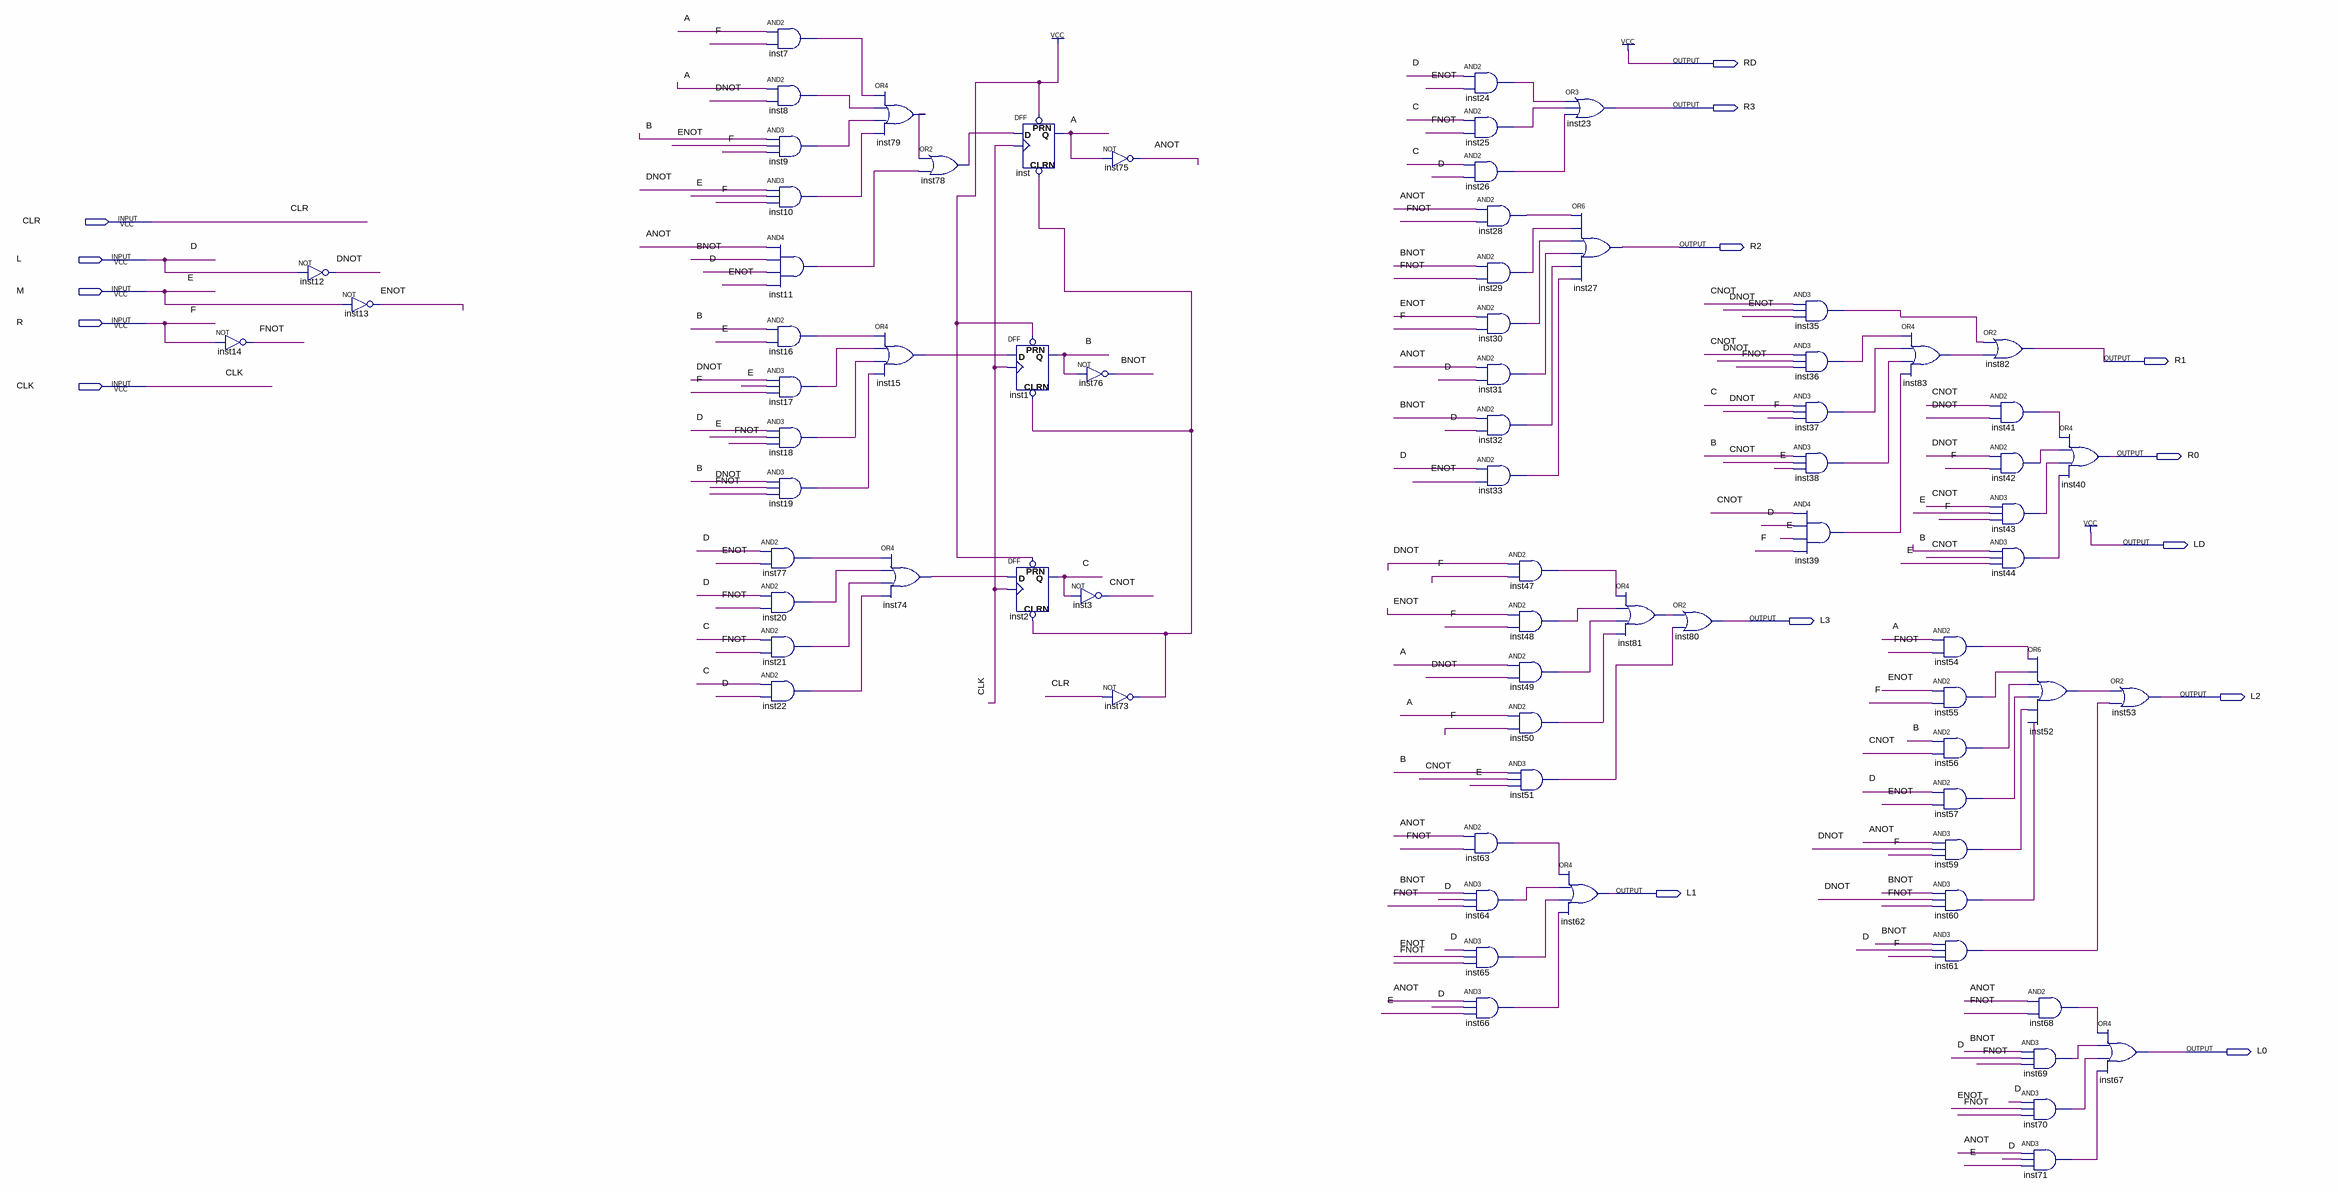
[diagram p0: schematic sheet]
// Quartus schematic SM.bdf as structural Verilog: 76 symbols, 15 pins
module SM (
  input  CLR,
  input  L,
  input  M,
  input  R,
  input  CLK,
  output RD,
  output R3,
  output R2,
  output R1,
  output R0,
  output LD,
  output L3,
  output L2,
  output L1,
  output L0
);

  wire A, ANOT, B, BNOT, C, CNOT, DNOT, ENOT, FNOT, inst7_out, inst8_out, inst9_out, inst10_out, inst11_out,
       inst15_out, inst16_out, inst17_out, inst18_out, inst19_out, inst20_out, inst21_out, inst22_out,
       inst24_out, inst25_out, inst26_out, inst28_out, inst29_out, inst30_out, inst31_out, inst32_out,
       inst33_out, inst35_out, inst36_out, inst37_out, inst38_out, inst39_out, inst41_out, inst42_out,
       inst43_out, inst44_out, inst47_out, inst48_out, inst49_out, inst50_out, inst51_out, inst52_out,
       inst54_out, inst55_out, inst56_out, inst57_out, inst59_out, inst60_out, inst61_out, inst63_out,
       inst64_out, inst65_out, inst66_out, inst68_out, inst69_out, inst70_out, inst71_out, inst73_out,
       inst74_out, inst77_out, inst78_out, inst79_out, inst81_out, inst83_out;

  not inst14 (FNOT, R);
  not inst12 (DNOT, L);
  not inst13 (ENOT, M);
  and inst7 (inst7_out, A, R);
  and inst8 (inst8_out, A, DNOT);
  and inst9 (inst9_out, B, ENOT, R);
  and inst10 (inst10_out, DNOT, M, R);
  and inst11 (inst11_out, ANOT, BNOT, L, ENOT);
  and inst16 (inst16_out, B, M);
  and inst17 (inst17_out, DNOT, M, R);
  and inst18 (inst18_out, L, M, FNOT);
  and inst19 (inst19_out, B, DNOT, FNOT);
  and inst77 (inst77_out, L, ENOT);
  and inst20 (inst20_out, L, FNOT);
  and inst21 (inst21_out, C, FNOT);
  and inst22 (inst22_out, C, L);
  or inst79 (inst79_out, inst7_out, inst8_out, inst9_out, inst10_out);
  or inst78 (inst78_out, inst79_out, inst11_out);
  or inst15 (inst15_out, inst16_out, inst17_out, inst18_out, inst19_out);
  or inst74 (inst74_out, inst77_out, inst20_out, inst21_out, inst22_out);
  DFF inst (.CLRN(inst73_out), .CLK(CLK), .D(inst78_out), .PRN(1'b1), .Q(A));
  DFF inst1 (.CLRN(inst73_out), .CLK(CLK), .D(inst15_out), .PRN(1'b1), .Q(B));
  DFF inst2 (.CLRN(inst73_out), .CLK(CLK), .D(inst74_out), .PRN(1'b1), .Q(C));
  not inst3 (CNOT, C);
  not inst75 (ANOT, A);
  not inst76 (BNOT, B);
  not inst73 (inst73_out, CLR);
  and inst24 (inst24_out, L, ENOT);
  and inst25 (inst25_out, C, FNOT);
  and inst26 (inst26_out, C, L);
  and inst28 (inst28_out, ANOT, FNOT);
  and inst29 (inst29_out, BNOT, FNOT);
  and inst30 (inst30_out, ENOT, R);
  and inst31 (inst31_out, ANOT, L);
  and inst32 (inst32_out, BNOT, L);
  and inst33 (inst33_out, L, ENOT);
  and inst63 (inst63_out, ANOT, FNOT);
  and inst64 (inst64_out, BNOT, L, FNOT);
  and inst65 (inst65_out, L, ENOT, FNOT);
  and inst66 (inst66_out, ANOT, L, M);
  and inst47 (inst47_out, DNOT, R);
  and inst48 (inst48_out, ENOT, R);
  and inst49 (inst49_out, A, DNOT);
  and inst50 (inst50_out, A, R);
  and inst51 (inst51_out, B, CNOT, M);
  or inst23 (R3, inst24_out, inst25_out, inst26_out);
  or inst27 (R2, inst28_out, inst29_out, inst30_out, inst31_out, inst32_out, inst33_out);
  or inst62 (L1, inst63_out, inst64_out, inst65_out, inst66_out);
  or inst81 (inst81_out, inst47_out, inst48_out, inst49_out, inst50_out);
  or inst80 (L3, inst81_out, inst51_out);
  and inst35 (inst35_out, CNOT, DNOT, ENOT);
  and inst36 (inst36_out, CNOT, DNOT, FNOT);
  and inst37 (inst37_out, C, DNOT, R);
  and inst38 (inst38_out, B, CNOT, M);
  and inst39 (inst39_out, CNOT, L, M, R);
  or inst83 (inst83_out, inst36_out, inst37_out, inst38_out, inst39_out);
  and inst54 (inst54_out, A, FNOT);
  and inst55 (inst55_out, ENOT, R);
  and inst56 (inst56_out, B, CNOT);
  and inst57 (inst57_out, L, ENOT);
  and inst59 (inst59_out, ANOT, DNOT, R);
  and inst60 (inst60_out, BNOT, DNOT, FNOT);
  and inst61 (inst61_out, BNOT, L, R);
  or inst82 (R1, inst35_out, inst83_out);
  and inst41 (inst41_out, CNOT, DNOT);
  and inst42 (inst42_out, DNOT, R);
  and inst43 (inst43_out, CNOT, M, R);
  and inst44 (inst44_out, B, CNOT, M);
  or inst52 (inst52_out, inst54_out, inst55_out, inst56_out, inst57_out, inst59_out, inst60_out);
  and inst68 (inst68_out, ANOT, FNOT);
  and inst69 (inst69_out, BNOT, L, FNOT);
  and inst70 (inst70_out, L, ENOT, FNOT);
  and inst71 (inst71_out, ANOT, L, M);
  or inst40 (R0, inst41_out, inst42_out, inst43_out, inst44_out);
  or inst53 (L2, inst52_out, inst61_out);
  or inst67 (L0, inst68_out, inst69_out, inst70_out, inst71_out);

  assign LD = 1'b1;
  assign RD = 1'b1;

  // Other names for the same wires on the sheet: D = L; E = M; F = R
endmodule
